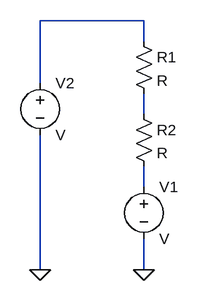
[diagram p0: schematic second_test.asc]
second_test.asc, the LTspice schematic file:
Version 4
SHEET 1 880 680
WIRE 288 0 128 0
WIRE 288 32 288 0
WIRE 128 96 128 0
WIRE 288 144 288 112
WIRE 288 256 288 224
WIRE 128 384 128 176
WIRE 288 384 288 336
FLAG 128 384 0
FLAG 288 384 0
SYMBOL res 272 16 R0
SYMATTR InstName R1
SYMBOL res 272 128 R0
SYMATTR InstName R2
SYMBOL voltage 288 240 R0
SYMATTR InstName V1
SYMBOL voltage 128 80 R0
SYMATTR InstName V2

The netlist it stands for:
* second_test.asc
R1 N001 N002 R
R2 N002 N003 R
V1 N003 0 V
V2 N001 0 V
.backanno
.end